# EAGLE design QFN12 (EAGLE 9.2.2)
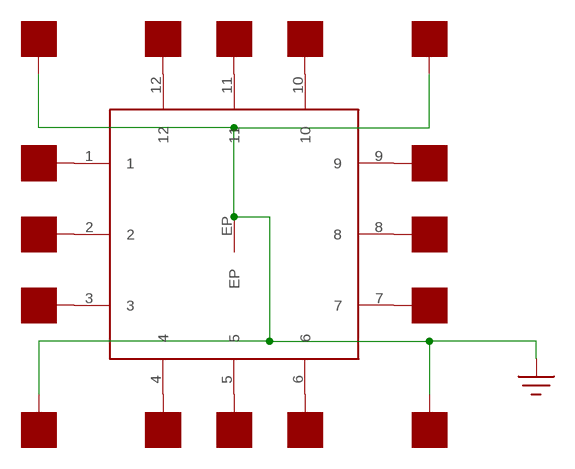
[diagram p0: schematic, sheet 1]

## Parts
U$1  QFN12  [QFN12-3X3]
U$2  PAD50MIL  [PAD_50MIL]
U$3  PAD50MIL  [PAD_50MIL]
U$4  PAD50MIL  [PAD_50MIL]
U$5  PAD50MIL  [PAD_50MIL]
U$6  PAD50MIL  [PAD_50MIL]
U$7  PAD50MIL  [PAD_50MIL]
U$8  PAD50MIL  [PAD_50MIL]
U$9  PAD50MIL  [PAD_50MIL]
U$10  PAD50MIL  [PAD_50MIL]
U$11  PAD50MIL  [PAD_50MIL]
U$12  PAD50MIL  [PAD_50MIL]
U$13  PAD50MIL  [PAD_50MIL]
U$14  PAD50MIL  [PAD_50MIL]
U$15  PAD50MIL  [PAD_50MIL]
U$16  PAD50MIL  [PAD_50MIL]
U$17  PAD50MIL  [PAD_50MIL]

## Nets
GND: U$1.EP U$14.P$1 U$15.P$1 U$16.P$1 U$17.P$1
N$1: U$1.9 U$2.P$1
N$2: U$1.8 U$3.P$1
N$3: U$1.7 U$4.P$1
N$4: U$1.10 U$5.P$1
N$5: U$1.11 U$6.P$1
N$6: U$1.12 U$7.P$1
N$7: U$1.2 U$9.P$1
N$8: U$1.3 U$10.P$1
N$9: U$1.4 U$11.P$1
N$10: U$1.5 U$12.P$1
N$11: U$1.6 U$13.P$1
N$12: U$1.1 U$8.P$1

## Library data of the parts
U$1 = yapo:QFN12
U$2-U$17 = yapo:PAD

## Board
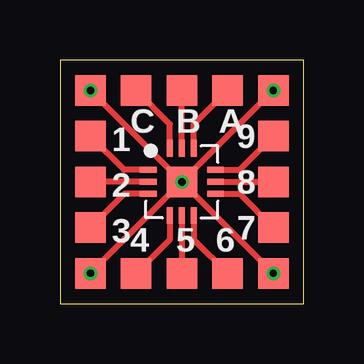
[diagram p1: board, top side]
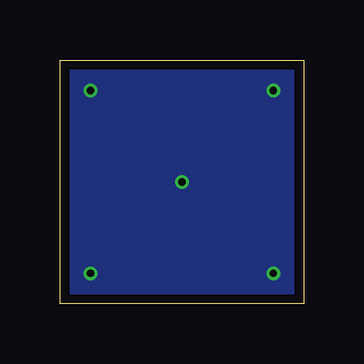
[diagram p2: board, bottom side, seen from below]

Size 10.16 x 10.16 mm. Coordinates in mm from the lower left corner, seen from the top.
Outline: 0,0 10.16,0 10.16,10.16 0,10.16 0,0
Copper layers (1*16): Top 0.035559375mm / dielectric 1.6mm / Bottom 0.035559375mm
Design rules "oshpark-2layer": minimum track width 6mil, minimum drill 10mil, track to track 6mil, track to pad 6mil, pad to pad 6mil, via to via 6mil, smd to smd 6mil, copper to edge 15mil, drill to drill 6mil, minimum pad ring 5mil, minimum via ring 5mil, stop-mask expansion 2.5mil, vias tented up to drill 0mil, thermal gap 10mil

### Footprints (pad centres in the part's own frame; a part is rotated, then mirrored left to right if it is on the bottom)
QFN12-3X3 = smd 0.7 x 0.25: 1 -1.4,0.5; 2 -1.4,0; 3 -1.4,-0.5; 7 1.4,-0.5; 8 1.4,0; 9 1.4,0.5 | smd 0.25 x 0.7: 4 -0.5,-1.4; 5 0,-1.4; 6 0.5,-1.4; 10 0.5,1.4; 11 0,1.4; 12 -0.5,1.4 | smd 1.27 x 1.27: EP 0,0
PAD_50MIL = smd 1.27 x 1.27: P$1 0,0

### Placement (x,y rotation side)
U$1  5.08,5.08 0 top
U$2  8.89,6.99 0 top
U$3  8.89,5.08 0 top
U$4  8.89,3.17 0 top
U$5  6.99,8.89 0 top
U$6  5.08,8.89 0 top
U$7  3.17,8.89 0 top
U$8  1.27,6.99 0 top
U$9  1.27,5.08 0 top
U$10  1.27,3.17 0 top
U$11  3.17,1.27 0 top
U$12  5.08,1.27 0 top
U$13  6.99,1.27 0 top
U$14  1.27,1.27 0 top
U$15  1.27,8.89 0 top
U$16  8.89,8.89 0 top
U$17  8.89,1.27 0 top

### Tracks (layer width: path | path; a pad name or v marks a point on that pad's centre or on a via)
GND  (via drill 0.3)
  Top 0.254: U$1.EP U$14.P$1 | U$1.EP U$15.P$1 | U$1.EP U$16.P$1 | U$1.EP U$17.P$1
  other vias: 5.08,5.08 1.27,8.89 8.89,8.89 8.89,1.27 1.27,1.27
  pour Bottom: 0,0 10.16,0 10.16,10.16 0,10.16
N$1
  Top 0.254: U$1.9 7.49,5.58 U$2.P$1
N$2
  Top 0.254: U$1.8 U$3.P$1
N$3
  Top 0.254: U$1.7 7.49,4.58 U$4.P$1
N$4
  Top 0.254: U$1.10 5.58,7.49 U$5.P$1
N$5
  Top 0.254: U$1.11 U$6.P$1
N$6
  Top 0.254: U$1.12 4.58,7.49 U$7.P$1
N$7
  Top 0.254: U$1.2 U$9.P$1
N$8
  Top 0.254: U$1.3 2.67,4.58 U$10.P$1
N$9
  Top 0.254: U$1.4 4.58,2.67 U$11.P$1
N$10
  Top 0.254: U$1.5 U$12.P$1
N$11
  Top 0.254: U$1.6 5.58,2.67 U$13.P$1
N$12
  Top 0.254: U$1.1 2.67,5.58 U$8.P$1

### Text on the board
tPlace: C | B | A | 1 | 9 | 8 | 2 | 3 | 7 | 4 | 5 | 6